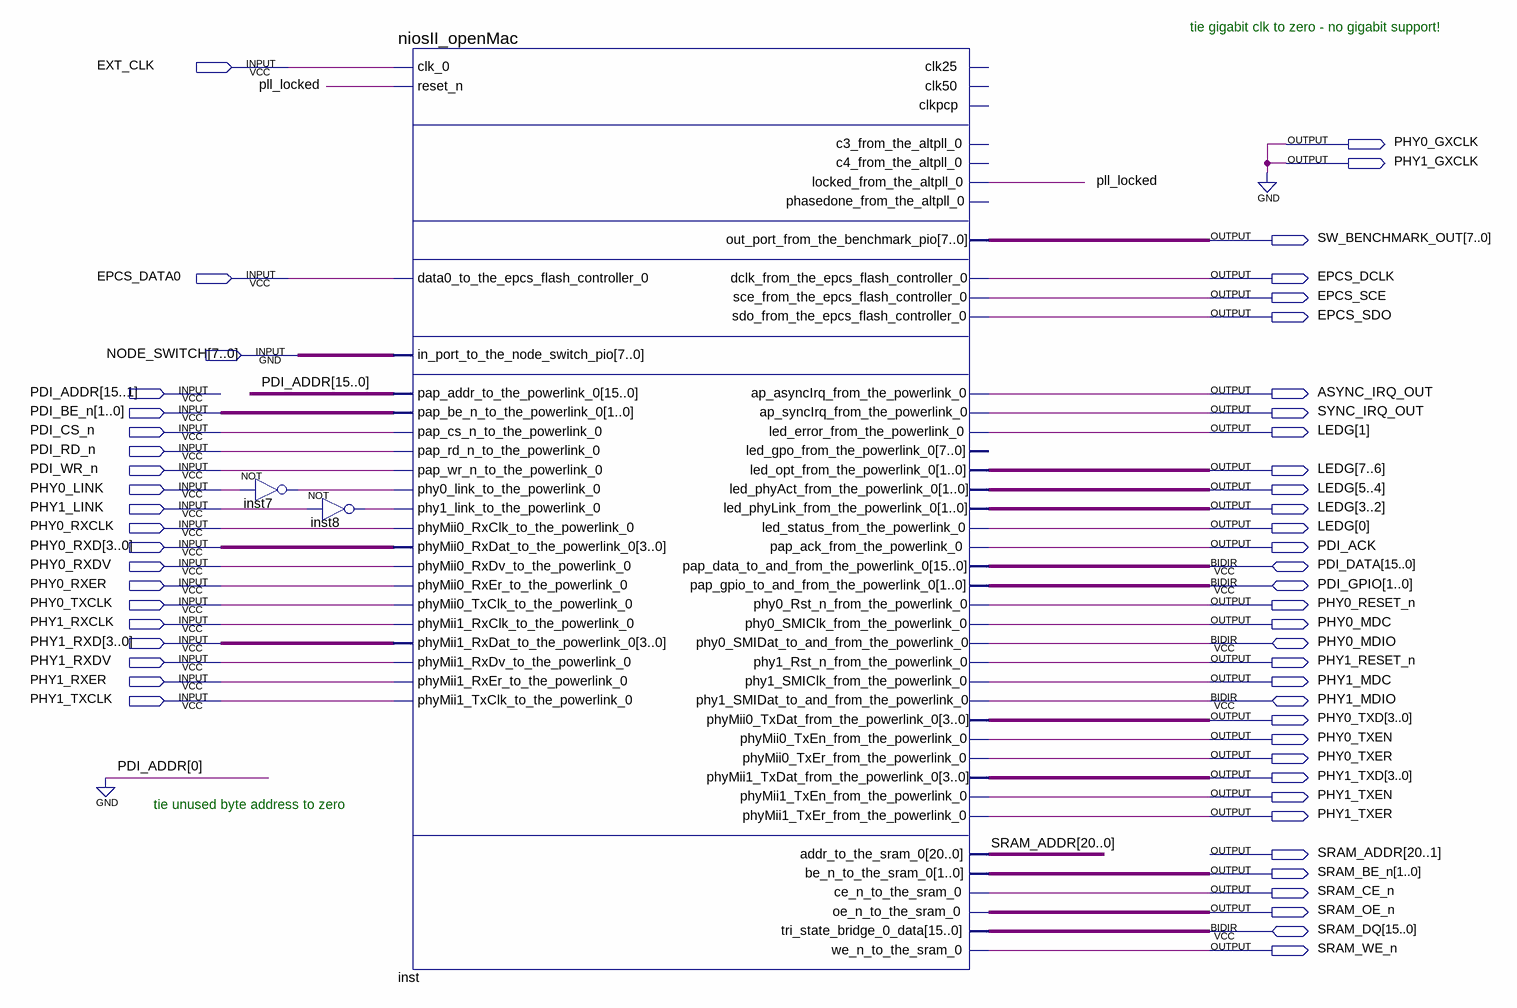
[diagram p0: schematic sheet]
// Quartus schematic nios_pll.bdf as structural Verilog: 3 symbols, 54 pins
module nios_pll (
  input  EXT_CLK,
  input  EPCS_DATA0,
  input  [7:0] NODE_SWITCH,
  input  [15:1] PDI_ADDR,
  input  [1:0] PDI_BE_n,
  input  PDI_CS_n,
  input  PDI_RD_n,
  input  PDI_WR_n,
  input  PHY0_LINK,
  input  PHY1_LINK,
  input  PHY0_RXCLK,
  input  [3:0] PHY0_RXD,
  input  PHY0_RXDV,
  input  PHY0_RXER,
  input  PHY0_TXCLK,
  input  PHY1_RXCLK,
  input  [3:0] PHY1_RXD,
  input  PHY1_RXDV,
  input  PHY1_RXER,
  input  PHY1_TXCLK,
  inout  [15:0] PDI_DATA,
  inout  [1:0] PDI_GPIO,
  inout  PHY0_MDIO,
  inout  PHY1_MDIO,
  inout  [15:0] SRAM_DQ,
  output PHY0_GXCLK,
  output PHY1_GXCLK,
  output [7:0] SW_BENCHMARK_OUT,
  output EPCS_DCLK,
  output EPCS_SCE,
  output EPCS_SDO,
  output ASYNC_IRQ_OUT,
  output SYNC_IRQ_OUT,
  output [7:0] LEDG,
  output PDI_ACK,
  output PHY0_RESET_n,
  output PHY0_MDC,
  output PHY1_RESET_n,
  output PHY1_MDC,
  output [3:0] PHY0_TXD,
  output PHY0_TXEN,
  output PHY0_TXER,
  output [3:0] PHY1_TXD,
  output PHY1_TXEN,
  output PHY1_TXER,
  output [20:0] SRAM_ADDR,
  output [1:0] SRAM_BE_n,
  output SRAM_CE_n,
  output SRAM_OE_n,
  output SRAM_WE_n
);

  wire inst7_out, inst8_out, pll_locked;

  not inst7 (inst7_out, PHY0_LINK);
  not inst8 (inst8_out, PHY1_LINK);
  niosII_openMac inst (
    .clk_0(EXT_CLK), .reset_n(pll_locked), .data0_to_the_epcs_flash_controller_0(EPCS_DATA0),
    .in_port_to_the_node_switch_pio(NODE_SWITCH), .pap_addr_to_the_powerlink_0({PDI_ADDR, 1'b0}),
    .pap_be_n_to_the_powerlink_0(PDI_BE_n), .pap_cs_n_to_the_powerlink_0(PDI_CS_n),
    .pap_rd_n_to_the_powerlink_0(PDI_RD_n), .pap_wr_n_to_the_powerlink_0(PDI_WR_n),
    .phy0_link_to_the_powerlink_0(inst7_out), .phy1_link_to_the_powerlink_0(inst8_out),
    .phyMii0_RxClk_to_the_powerlink_0(PHY0_RXCLK), .phyMii0_RxDat_to_the_powerlink_0(PHY0_RXD),
    .phyMii0_RxDv_to_the_powerlink_0(PHY0_RXDV), .phyMii0_RxEr_to_the_powerlink_0(PHY0_RXER),
    .phyMii0_TxClk_to_the_powerlink_0(PHY0_TXCLK), .phyMii1_RxClk_to_the_powerlink_0(PHY1_RXCLK),
    .phyMii1_RxDat_to_the_powerlink_0(PHY1_RXD), .phyMii1_RxDv_to_the_powerlink_0(PHY1_RXDV),
    .phyMii1_RxEr_to_the_powerlink_0(PHY1_RXER), .phyMii1_TxClk_to_the_powerlink_0(PHY1_TXCLK),
    .locked_from_the_altpll_0(pll_locked), .out_port_from_the_benchmark_pio(SW_BENCHMARK_OUT),
    .dclk_from_the_epcs_flash_controller_0(EPCS_DCLK), .sce_from_the_epcs_flash_controller_0(EPCS_SCE),
    .sdo_from_the_epcs_flash_controller_0(EPCS_SDO), .ap_asyncIrq_from_the_powerlink_0(ASYNC_IRQ_OUT),
    .ap_syncIrq_from_the_powerlink_0(SYNC_IRQ_OUT), .led_error_from_the_powerlink_0(LEDG[1]),
    .led_opt_from_the_powerlink_0(LEDG[7:6]), .led_phyAct_from_the_powerlink_0(LEDG[5:4]),
    .led_phyLink_from_the_powerlink_0(LEDG[3:2]), .led_status_from_the_powerlink_0(LEDG[0]),
    .pap_ack_from_the_powerlink_0(PDI_ACK), .phy0_Rst_n_from_the_powerlink_0(PHY0_RESET_n),
    .phy0_SMIClk_from_the_powerlink_0(PHY0_MDC), .phy1_Rst_n_from_the_powerlink_0(PHY1_RESET_n),
    .phy1_SMIClk_from_the_powerlink_0(PHY1_MDC), .phyMii0_TxDat_from_the_powerlink_0(PHY0_TXD),
    .phyMii0_TxEn_from_the_powerlink_0(PHY0_TXEN), .phyMii0_TxEr_from_the_powerlink_0(PHY0_TXER),
    .phyMii1_TxDat_from_the_powerlink_0(PHY1_TXD), .phyMii1_TxEn_from_the_powerlink_0(PHY1_TXEN),
    .phyMii1_TxEr_from_the_powerlink_0(PHY1_TXER), .addr_to_the_sram_0(SRAM_ADDR),
    .be_n_to_the_sram_0(SRAM_BE_n), .ce_n_to_the_sram_0(SRAM_CE_n), .oe_n_to_the_sram_0(SRAM_OE_n),
    .we_n_to_the_sram_0(SRAM_WE_n), .pap_data_to_and_from_the_powerlink_0(PDI_DATA),
    .pap_gpio_to_and_from_the_powerlink_0(PDI_GPIO), .phy0_SMIDat_to_and_from_the_powerlink_0(PHY0_MDIO),
    .phy1_SMIDat_to_and_from_the_powerlink_0(PHY1_MDIO), .tri_state_bridge_0_data(SRAM_DQ));  // open: clk25, clk50, clkpcp, c3_from_the_altpll_0, c4_from_the_altpll_0, phasedone_from_the_altpll_0, led_gpo_from_the_powerlink_0

  assign PHY0_GXCLK = 1'b0;
  assign PHY1_GXCLK = 1'b0;

  // Notes on the sheet:
  //   tie gigabit clk to zero - no gigabit support!
  //   tie unused byte address to zero
endmodule
